# Altium schematic sheet PAM8302A.SchDoc
size A4; SheetNumber: 9; SheetTotal: 17
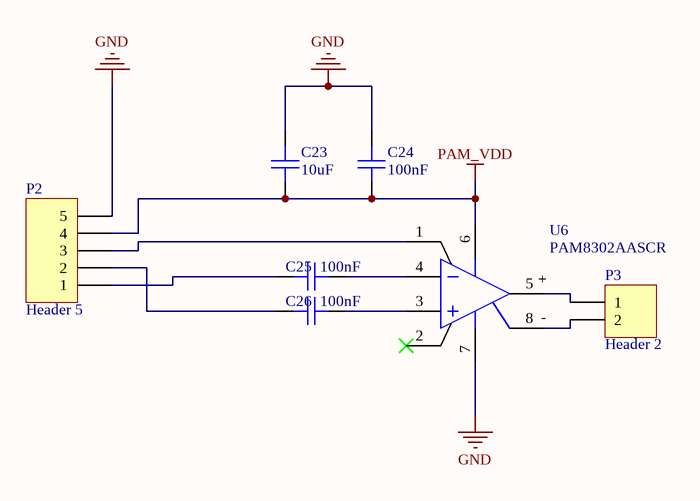
[diagram p0: PAM8302A.SchDoc]

## Parts
C23  10uF  [C0603]
C24  100nF  [C0402]
C25  100nF  [C0402]
C26  100nF  [C0402]
P2  Header 5  [HDR1X5]
P3  Header 2  [HDR1X2]
U6  PAM8302AASCR  [MSOP-8_L3.0-W3.0-P0.65-LS5.0-BL]

## Nets
GND: C23.2 C24.2 P2.5 U6.7(GND)
PAM_VDD: C23.1 C24.1 P2.4 U6.6(VDD)
NetC25_1: C25.1 U6.4(IN-)
NetC25_2: C25.2 P2.1
NetC26_1: C26.1 U6.3(IN+)
NetC26_2: C26.2 P2.2
NetP2_3: P2.3 U6.1(SD#)
NetP3_1: P3.1 U6.5(VO+)
NetP3_2: P3.2 U6.8(VO-)

Not connected (* = marked no-connect by the designer): U6 2(NC)*

## Notes on the sheet
- (in symbol PAM8302AASCR) +; -

## Library data of the parts
C23 = CAP_0603: Symbol: CapAcitance; Convert to PCB: yes; Device: CAP_0603; Add into BOM: yes; Supplier Footprint: 0603; Value: 10uF; Name: 10uF
C24-C26 = CAP_0402: Symbol: CapAcitance; Device: CAP_0603; Convert to PCB: yes; Add into BOM: yes; Supplier Footprint: 0603; Value: 100nF; Name: 100nF
P2 = Header 5: Header, 5-Pin; LatestRevisionDate: 17-Jul-2002; LatestRevisionNote: Re-released for DXP Platform.; Publisher: Altium Limited
P3 = Header 2: Header, 2-Pin; LatestRevisionDate: 17-Jul-2002; LatestRevisionNote: Re-released for DXP Platform.; Publisher: Altium Limited
U6 = PAM8302AASCR: Manufacturer: DIODES(美台); Add into BOM: yes; Type of Power Amplifier: D类功放; Speaker Channels: 单声道; Output Power: 2.5Wx1@4Ω; Supply Voltage: 2V~5.5V; Symbol: PAM8302AASCR; Device: PAM8302AASCR; LCSC Part Name: 2.5W单声道D类音频功率放大器; Supplier Part: C113367; Manufacturer Part: PAM8302AASCR; Supplier Footprint: MSOP-8; Datasheet: https://atta.szlcsc.com/upload/public/pdf/source/20170606/1496716410034.pdf; Supplier: LCSC; Convert to PCB: yes; Operating Temperature: -40℃~+85℃; Name: PAM8302AASCR